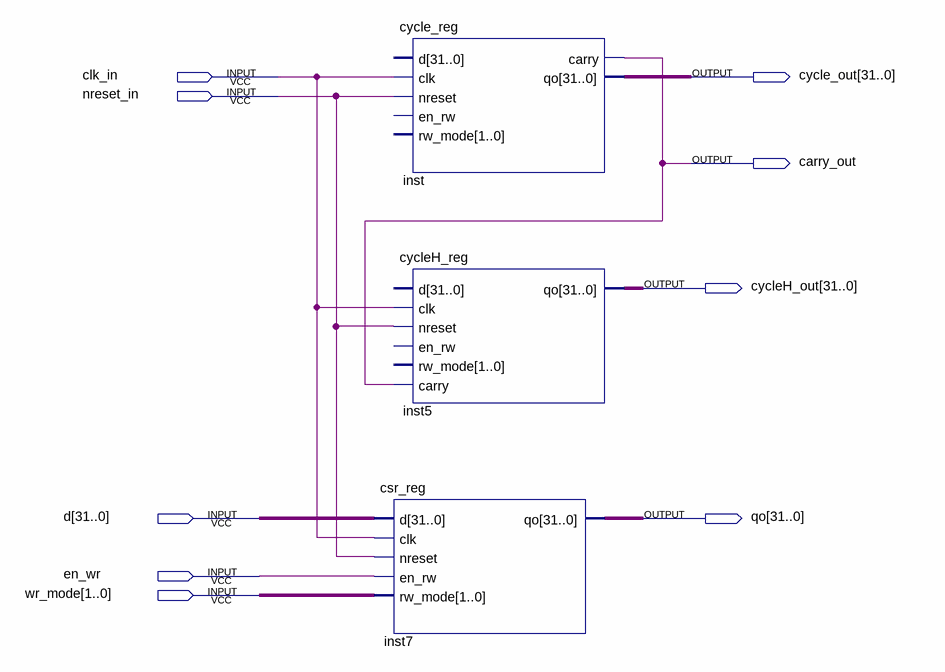
[diagram p0: schematic sheet]
// Quartus schematic csr_test.bdf as structural Verilog: 3 symbols, 9 pins
module csr_test (
  input  clk_in,
  input  nreset_in,
  input  [31:0] d,
  input  en_wr,
  input  [1:0] wr_mode,
  output [31:0] cycle_out,
  output carry_out,
  output [31:0] cycleH_out,
  output [31:0] qo
);

  cycle_reg inst (.clk(clk_in), .nreset(nreset_in), .carry(carry_out), .qo(cycle_out));  // open: d, en_rw, rw_mode
  cycleH_reg inst5 (.clk(clk_in), .nreset(nreset_in), .carry(carry_out), .qo(cycleH_out));  // open: d, en_rw, rw_mode
  csr_reg inst7 (.d(d), .clk(clk_in), .nreset(nreset_in), .en_rw(en_wr), .rw_mode(wr_mode), .qo(qo));
endmodule
